# EAGLE design carrier (EAGLE 9.6.2)
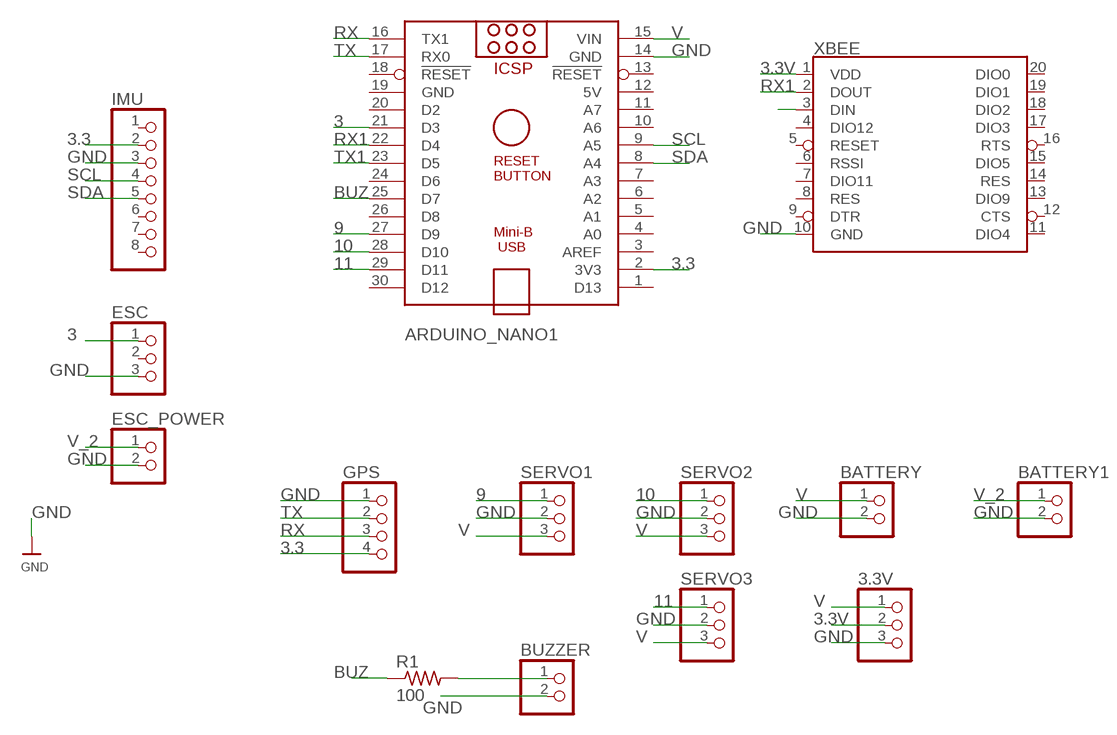
[diagram p0: schematic, sheet 1]

## Parts
3.3V  PINHD-1X3  [1X03]
ARDUINO_NANO1  ARDUINO_NANO  [ARDUINO_NANO]
BATTERY  PINHD-1X2  [1X02]
BATTERY1  PINHD-1X2  [1X02]
BUZZER  PINHD-1X2  [1X02]
ESC  PINHD-1X3  [1X03]
ESC_POWER  PINHD-1X2  [1X02]
GPS  PINHD-1X4  [1X04]
IMU  PINHD-1X8  [1X08]
R1  100  R-US_M0805  [M0805]
SERVO1  PINHD-1X3  [1X03]
SERVO2  PINHD-1X3  [1X03]
SERVO3  PINHD-1X3  [1X03]
XBEE  XBEE  [XBEE]

## Nets
3: ARDUINO_NANO1.21(D3) ESC.1
3.3: ARDUINO_NANO1.2(3V3) GPS.4 IMU.2
3.3V: 3.3V.2 XBEE.1(VDD)
9: ARDUINO_NANO1.27(D9) SERVO1.1
10: ARDUINO_NANO1.28(D10) SERVO2.1
11: ARDUINO_NANO1.29(D11) SERVO3.1
BUZ: ARDUINO_NANO1.25(D7) R1.1
GND: 3.3V.3 ARDUINO_NANO1.14(GND) BATTERY1.2 BATTERY.2 BUZZER.2 ESC.3 ESC_POWER.2 GPS.1 IMU.3 SERVO1.2 SERVO2.2 SERVO3.2 XBEE.10(GND)
N$1: BUZZER.1 R1.2
RX: ARDUINO_NANO1.16(TX1) GPS.3
RX1: ARDUINO_NANO1.22(D4) XBEE.2(DOUT)
SCL: ARDUINO_NANO1.9(A5) IMU.4
SDA: ARDUINO_NANO1.8(A4) IMU.5
TX: ARDUINO_NANO1.17(RX0) GPS.2
TX1: ARDUINO_NANO1.23(D5) XBEE.3(DIN)
V: 3.3V.1 ARDUINO_NANO1.15(VIN) BATTERY.1 SERVO1.3 SERVO2.3 SERVO3.3
V_2: BATTERY1.1 ESC_POWER.1
Unconnected: ARDUINO_NANO1.1(D13) ARDUINO_NANO1.3(AREF) ARDUINO_NANO1.4(A0) ARDUINO_NANO1.5(A1) ARDUINO_NANO1.6(A2) ARDUINO_NANO1.7(A3) ARDUINO_NANO1.10(A6) ARDUINO_NANO1.11(A7) ARDUINO_NANO1.13(!RESET) ARDUINO_NANO1.18(!RESET) ARDUINO_NANO1.20(D2) ARDUINO_NANO1.24(D6) ARDUINO_NANO1.26(D8) ARDUINO_NANO1.30(D12) ESC.2 IMU.1 IMU.6 IMU.7 IMU.8 XBEE.4(DIO12) XBEE.5(RESET) XBEE.6(RSSI) XBEE.7(DIO11) XBEE.8(RES) XBEE.9(DTR) XBEE.11(DIO4) XBEE.12(CTS) XBEE.13(DIO9) XBEE.14(RES) XBEE.15(DIO5) XBEE.16(RTS) XBEE.17(DIO3) XBEE.18(DIO2) XBEE.19(DIO1) XBEE.20(DIO0)

## Power pins joined to a net without a drawn wire
5V: ARDUINO_NANO1.12(5V)
GND: ARDUINO_NANO1.19(GND)

## Library data of the parts
3.3V ESC SERVO1-SERVO3 = Connector:PINHD-1X3: PIN HEADER; CATEGORY: CONNECTOR; SUB-CATEGORY: PIN-HEADER
ARDUINO_NANO1 = ArduinoNanoV30:ARDUINO_NANO: Arduino Nano V3.0 Overview: The Arduino Nano is a small, complete, and breadboard-friendly board based on the ATmega328 (Arduino Nano 3.x) or ATmega168 (Arduino Nano 2.x). It has more or less the same functionality of the Arduino Duemilanove, but in a different package. It lacks only a DC power jack, and works with a Mini-B USB cable instead of a standard one. The Nano was designed and is being produced by Gravitech. Specifications: Microcontroller Atmel ATmega168 or ATmega328 Operating Voltage (logic level) 5 V Input Voltage (recommended) 7-12 V Input Voltage (limits) 6-20 V Digital I/O Pins 14 (of which 6 provide PWM output) Analog Input Pins 8 DC Current per I/O Pin 40 mA Flash Memory 16 KB (ATmega168) or 32 KB (ATmega328) of which 2 KB used by bootloader SRAM 1 KB (ATmega168) or 2 KB (ATmega328) EEPROM 512 bytes (ATmega168) or 1 KB (ATmega328) Clock Speed 16 MHz Dimensions 0.73" x 1.70" Length 45 mm Width 18 mm Weigth 5 g Power: The Arduino Nano can be powered via the Mini-B USB connection, 6-20V unregulated external power supply (pin 30), or 5V regulated external power supply (pin 27). The power source is automatically selected to the highest voltage source. Memory: The ATmega168 has 16 KB of flash memory for storing code (of which 2 KB is used for the bootloader); the ATmega328 has 32 KB, (also with 2 KB used for the bootloader). The ATmega168 has 1 KB of SRAM and 512 bytes of EEPROM (which can be read and written with the EEPROM library); the ATmega328 has 2 KB of SRAM and 1 KB of EEPROM. Input and Output: Each of the 14 digital pins on the Nano can be used as an input or output, using pinMode(), digitalWrite(), and digitalRead() functions. They operate at 5 volts. Each pin can provide or receive a maximum of 40 mA and has an internal pull-up resistor (disconnected by default) of 20-50 kOhms. In addition, some pins have specialized functions. Visit Arduino - ArduinoBoardNano <https://www.arduino.cc/en/Main/ArduinoBoardNano>
BATTERY BATTERY1 BUZZER ESC_POWER = Connector:PINHD-1X2: PIN HEADER; CATEGORY: CONNECTOR; SUB-CATEGORY: PIN-HEADER
GPS = Connector:PINHD-1X4: PIN HEADER; CATEGORY: CONNECTOR; SUB-CATEGORY: PIN-HEADER
IMU = Connector:PINHD-1X8: PIN HEADER; CATEGORY: CONNECTOR; SUB-CATEGORY: PIN-HEADER
R1 = adafruit:R-US_: RESISTOR, American symbol
XBEE = SparkFun-RF:XBEE: Digi XBee and XBee Pro XBees are tiny blue chips that can communicate wirelessly with each other. They can do simple things, like replacing a couple of wires in serial communication, which is nice when you want to make a remote for your paintball vehicle. SparkFun Products SparkFun XBee Buying Guide <https://www.sparkfun.com/pages/xbee_guide> SparkFun XBee Explorer USB <https://www.sparkfun.com/products/11812> (WRL-11812) Breakout Board for XBee Module <https://www.sparkfun.com/products/8276> (WRL-8276) SparkFun XBee Explorer Regulated <https://www.sparkfun.com/products/11373> (WRL-11373) SparkFun XBee Explorer Dongle <https://www.sparkfun.com/products/11697> (WRL-11697) SparkFun XBee Shield <https://www.sparkfun.com/products/12847> (WRL-12847) SparkFun XBee Explorer Serial <https://www.sparkfun.com/products/13225> (WRL-13225)

## Board
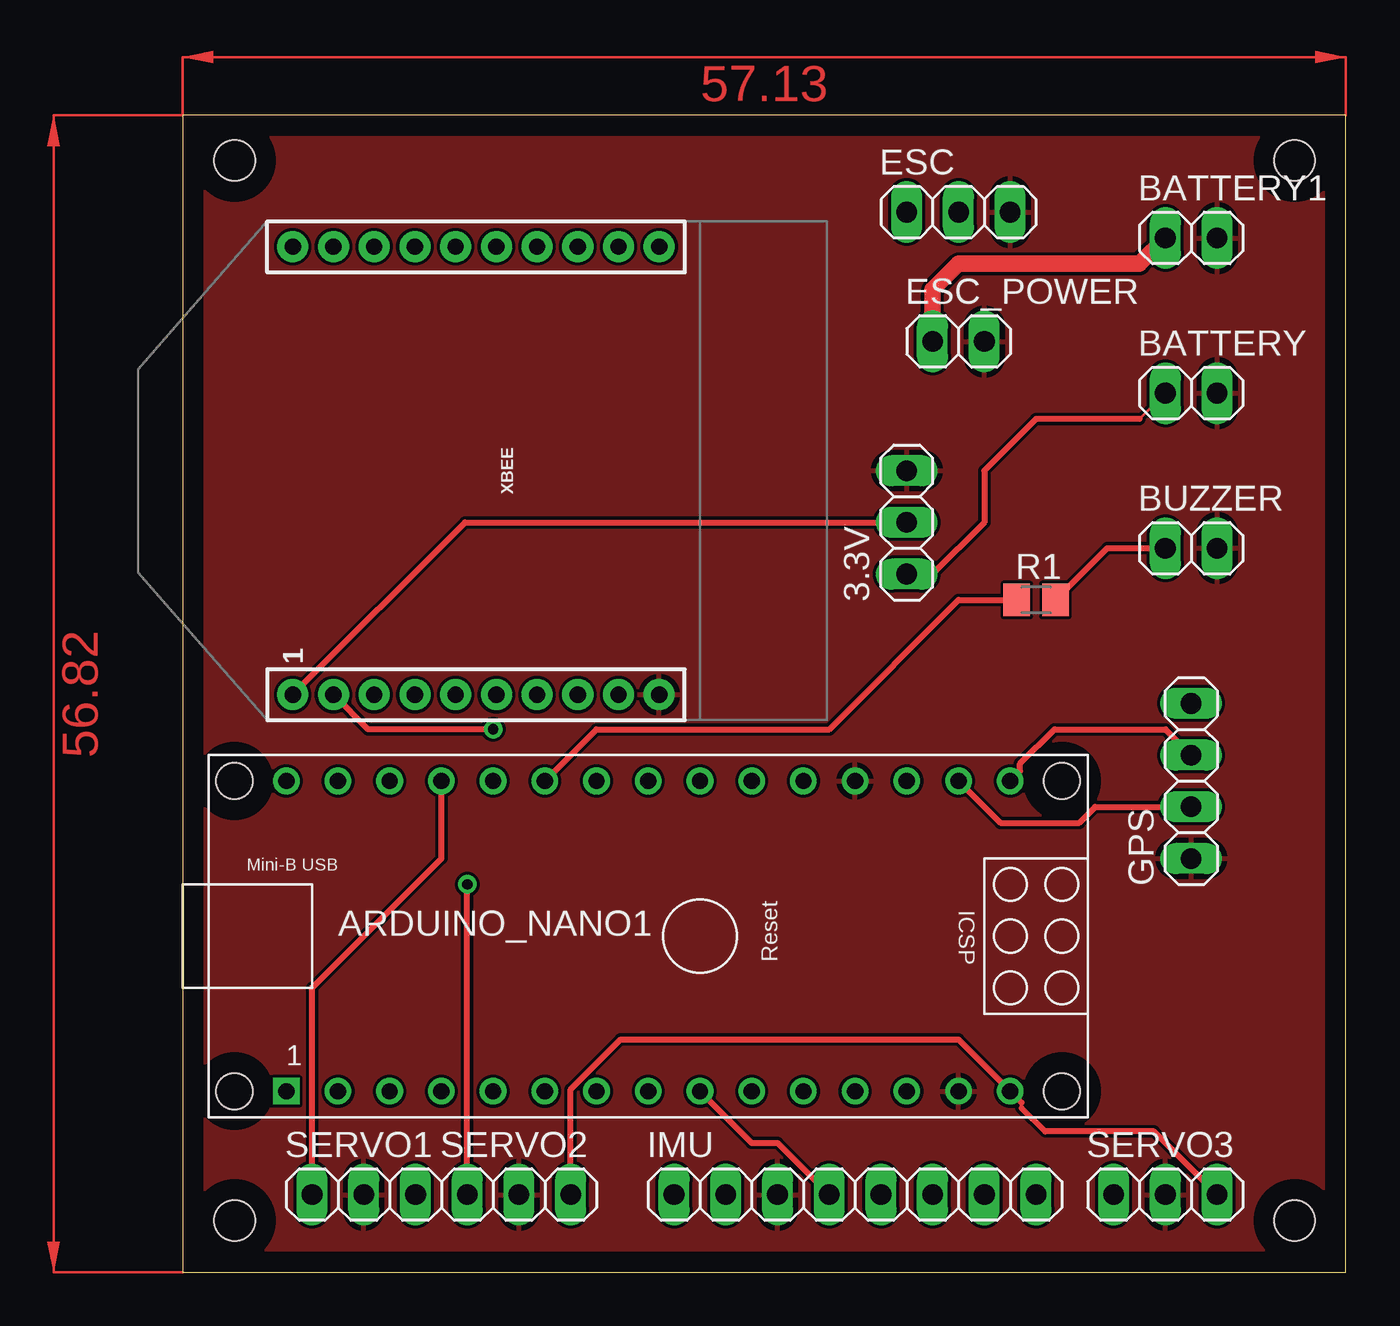
[diagram p1: board, top side]
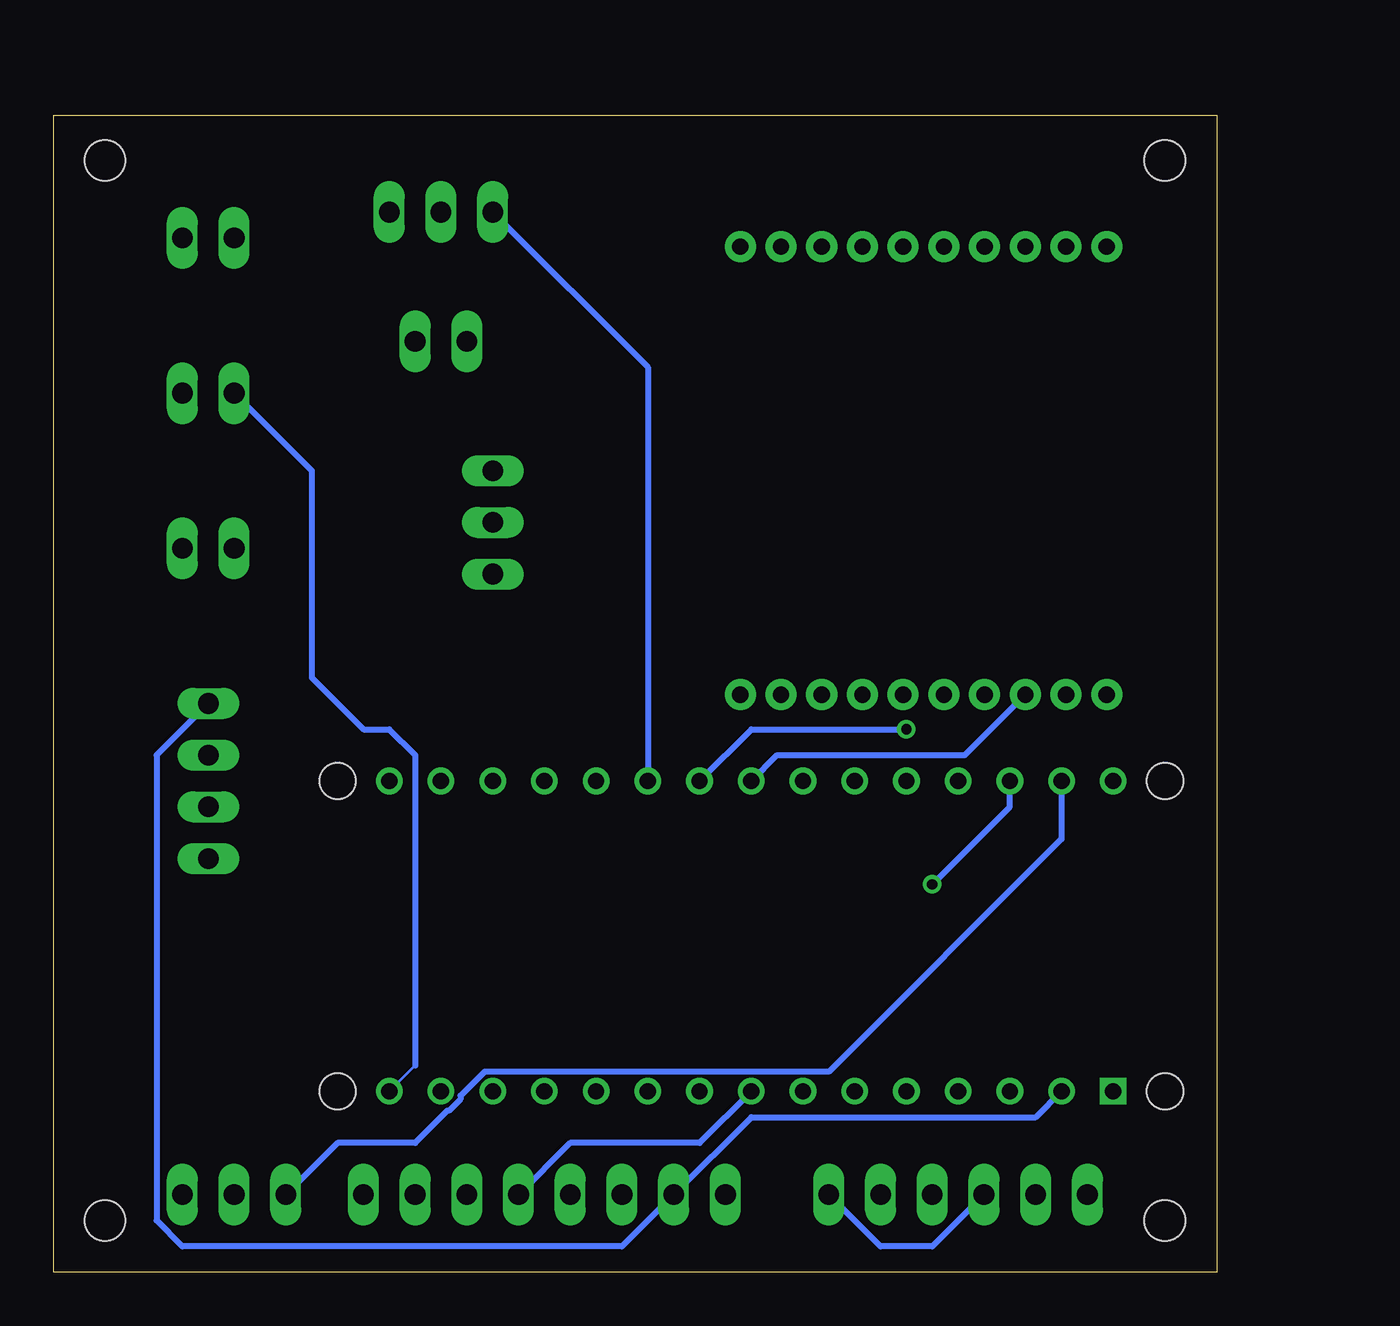
[diagram p2: board, bottom side, seen from below]

Size 57.13 x 56.82 mm. Coordinates in mm from the lower left corner, seen from the top.
Outline: 0,0 57.13,0 57.13,56.82 0,56.82 0,0
Copper layers (1*16): Top 0.035mm / dielectric 1.5mm / Bottom 0.035mm
Design rules "default": minimum track width 6mil, minimum drill 0.35mm, track to track 6mil, track to pad 6mil, pad to pad 6mil, via to via 6mil, smd to smd 6mil, copper to edge 40mil, drill to drill 6mil, minimum pad ring 10mil, minimum via ring 8mil, stop-mask expansion 4mil, vias tented up to drill 0mil, thermal gap 10mil
Holes 2 mm at 54.61,2.54 2.54,54.61 54.61,54.61 2.54,2.54

### Footprints (pad centres in the part's own frame; a part is rotated, then mirrored left to right if it is on the bottom)
1X03 = drill 1.016 long: 1 -2.54,0; 2 0,0; 3 2.54,0
ARDUINO_NANO = drill 0.8 square: 1 -20.32,-7.62 | drill 0.8: 2 -17.78,-7.62; 3 -15.24,-7.62; 4 -12.7,-7.62; 5 -10.16,-7.62; 6 -7.62,-7.62; 7 -5.08,-7.62; 8 -2.54,-7.62; 9 0,-7.62; 10 2.54,-7.62; 11 5.08,-7.62; 12 7.62,-7.62; 13 10.16,-7.62; 14 12.7,-7.62; 15 15.24,-7.62; 16 15.24,7.62; 17 12.7,7.62; 18 10.16,7.62; 19 7.62,7.62; 20 5.08,7.62; 21 2.54,7.62; 22 0,7.62; 23 -2.54,7.62; 24 -5.08,7.62; 25 -7.62,7.62; 26 -10.16,7.62; 27 -12.7,7.62; 28 -15.24,7.62; 29 -17.78,7.62; 30 -20.32,7.62 | hole 1.778: -22.86,-7.62; -22.86,7.62; 17.78,7.62; 17.78,-7.62
1X02 = drill 1.016 long: 1 -1.27,0; 2 1.27,0
1X04 = drill 1.016 long: 1 -3.81,0; 2 -1.27,0; 3 1.27,0; 4 3.81,0
1X08 = drill 1.016 long: 1 -8.89,0; 2 -6.35,0; 3 -3.81,0; 4 -1.27,0; 5 1.27,0; 6 3.81,0; 7 6.35,0; 8 8.89,0
M0805 = smd 1.3 x 1.6: 1 -0.95,0; 2 0.95,0
XBEE = drill 0.8 pad 1.524: 1 -11,20; 2 -11,18; 3 -11,16; 4 -11,14; 5 -11,12; 6 -11,10; 7 -11,8; 8 -11,6; 9 -11,4; 10 -11,2; 11 11,2; 12 11,4; 13 11,6; 14 11,8; 15 11,10; 16 11,12; 17 11,14; 18 11,16; 19 11,18; 20 11,20

### Placement (x,y rotation side)
3.3V  35.56,36.83 90 top
ARDUINO_NANO1  25.4,16.51 0 top
BATTERY  49.53,43.18 0 top
BATTERY1  49.53,50.8 0 top
BUZZER  49.53,35.56 0 top
ESC  38.1,52.07 0 top
ESC_POWER  38.1,45.72 0 top
GPS  49.53,24.13 90 top
IMU  33.02,3.81 0 top
R1  41.91,33.02 0 top
SERVO1  8.89,3.81 0 top
SERVO2  16.51,3.81 0 top
SERVO3  48.26,3.81 0 top
XBEE  25.4,39.37 90 top

### Tracks (layer width: path | path; a pad name or v marks a point on that pad's centre or on a via)
3
  Bottom 0.305: ESC.1 27.94,44.45 ARDUINO_NANO1.21
3.3
  Bottom 0.305: ARDUINO_NANO1.2 8.89,7.62 22.86,7.62 IMU.2 29.21,1.27 50.8,1.27 52.07,2.54 52.07,25.4 GPS.4
3.3V
  Top 0.305: XBEE.1 13.86,36.83 3.3V.2
9
  Top 0.305: SERVO1.1 6.35,13.97 12.7,20.32 ARDUINO_NANO1.27
10  (via drill 0.5)
  Top 0.305: SERVO2.1 v13.97,19.05
  Bottom 0.305: v13.97,19.05 10.16,22.86 ARDUINO_NANO1.28
11
  Bottom 0.305: SERVO3.1 43.18,6.35 39.37,6.35 37.79,7.93 37.7,7.93 37.14,8.49 37.14,8.66 35.96,9.85 19.05,9.85 7.62,21.28 ARDUINO_NANO1.29
BUZ
  Top 0.305: R1.1 38.1,33.02 31.75,26.67 20.32,26.67 ARDUINO_NANO1.25
GND
  pour Top: -2.54,58.42 -2.54,-2.54 59.69,-2.54 59.69,59.69 -1.27,59.69
N$1
  Top 0.305: R1.2 45.4,35.56 BUZZER.1
RX
  Top 0.305: ARDUINO_NANO1.16 41.12,24.61 41.12,24.98 42.81,26.67 48.26,26.67 GPS.3
RX1  (via drill 0.5)
  Top 0.305: v15.24,26.67 9.1,26.67 XBEE.2
  Bottom 0.305: ARDUINO_NANO1.22 22.86,26.67 v15.24,26.67
SCL
  Top 0.152: 31.75,5.08 IMU.4
  Top 0.305: ARDUINO_NANO1.9 27.94,6.35 29.21,6.35 IMU.4
SDA
  Bottom 0.305: ARDUINO_NANO1.8 25.4,6.35 31.75,6.35 IMU.5
TX
  Top 0.305: GPS.2 44.82,22.86 44.03,22.07 40.16,22.07 ARDUINO_NANO1.17
TX1
  Bottom 0.305: XBEE.3 12.37,25.4 21.59,25.4 ARDUINO_NANO1.23
V
  Top 0.152: BATTERY.1 46.99,41.91 | 36.83,34.29 3.3V.1 | 41.2,8.07 41.2,8.33
  Top 0.305: 46.99,41.91 41.91,41.91 39.37,39.37 39.37,36.83 36.83,34.29 | SERVO3.3 47.7,6.91 42.36,6.91 41.2,8.07 | 41.2,8.33 ARDUINO_NANO1.15 38.1,11.43 21.5,11.43 19.05,8.98 SERVO2.3
  Bottom 0.152: 39.37,10.16 ARDUINO_NANO1.15
  Bottom 0.305: BATTERY.1 44.45,39.37 44.45,29.21 41.91,26.67 40.64,26.67 39.37,25.4 39.37,10.16 | SERVO1.3 13.97,1.27 16.51,1.27 SERVO2.3
V_2
  Top 0.813: ESC_POWER.1 36.83,48.26 38.1,49.53 46.99,49.53 BATTERY1.1
(copper drawn outside any net)
  shapes: Top area x2